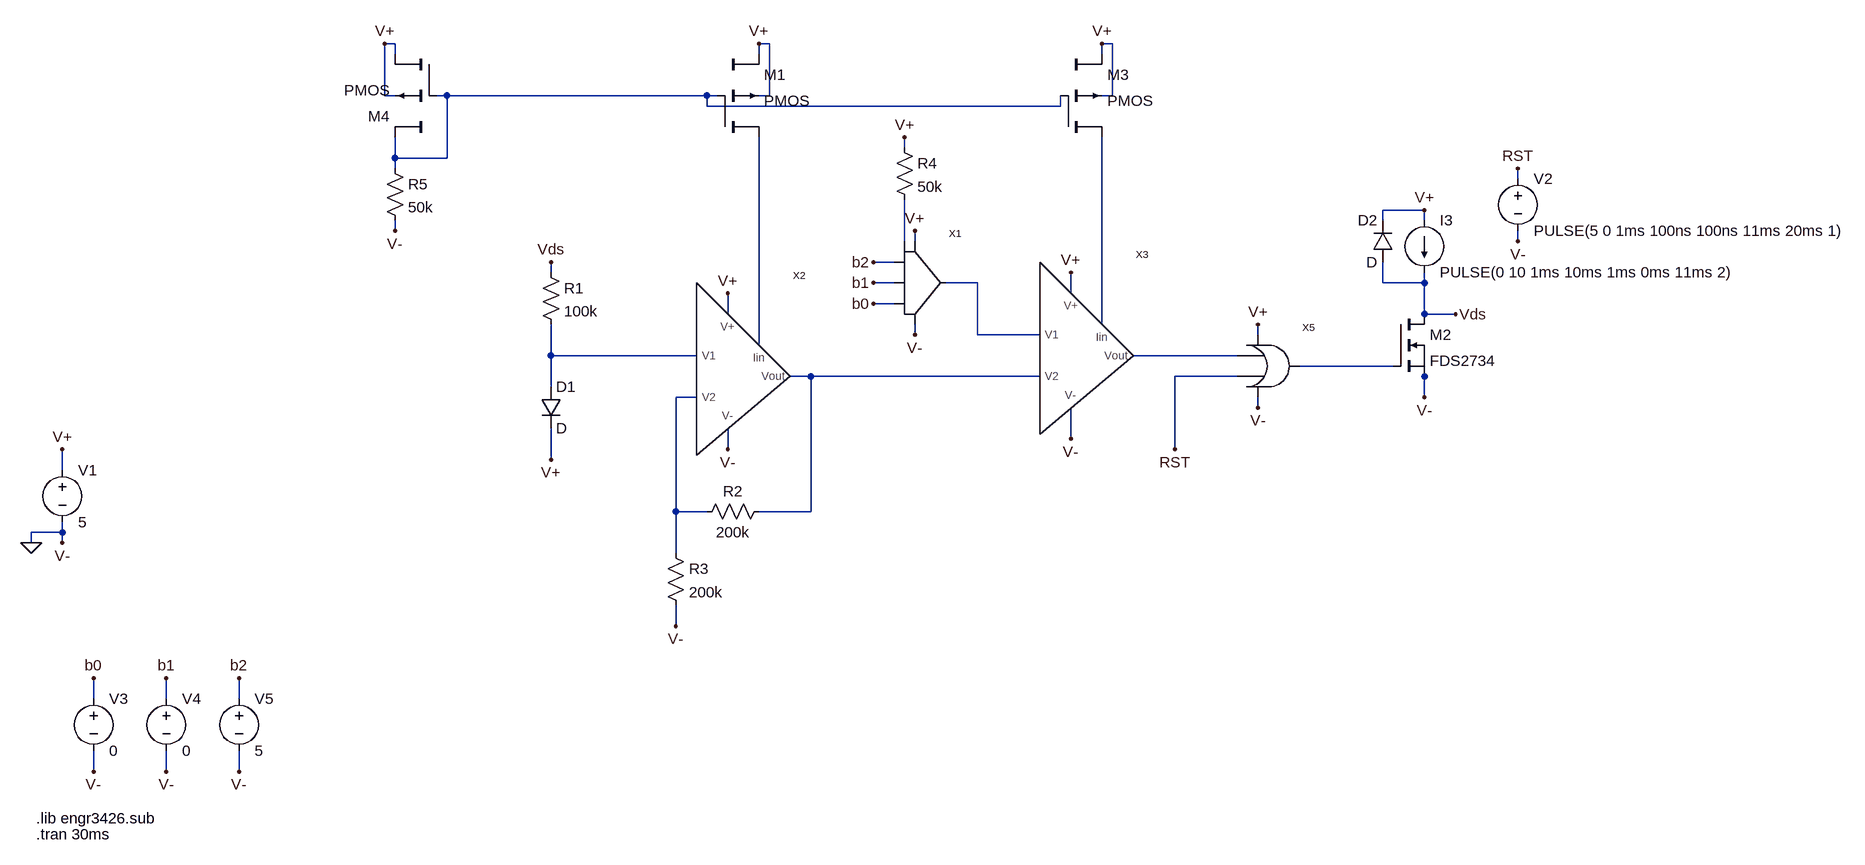
[diagram p0: schematic System.asc]
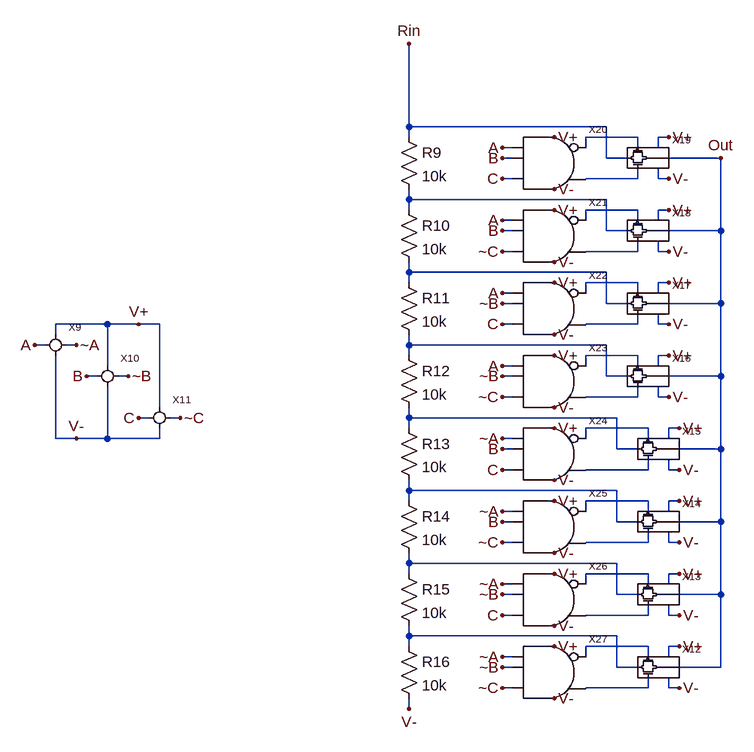
[diagram p1: sub-circuit dac.asc]
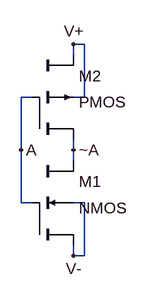
[diagram p2: sub-circuit inverter.asc]
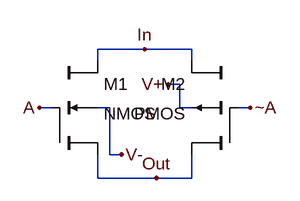
[diagram p3: sub-circuit passgate.asc]
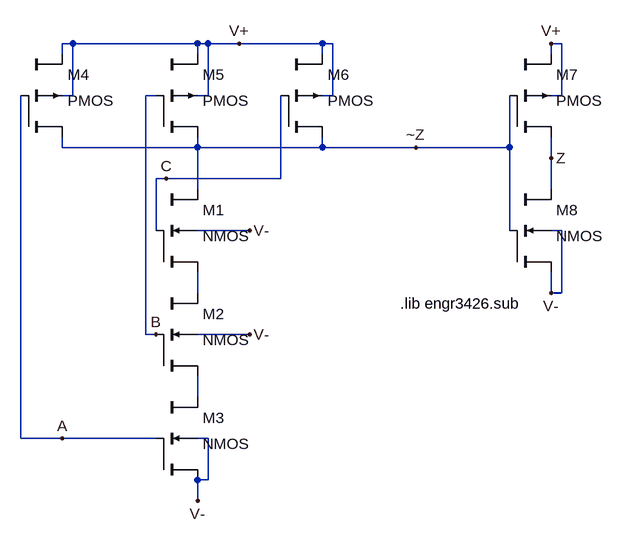
[diagram p4: sub-circuit 3-n-and.asc]
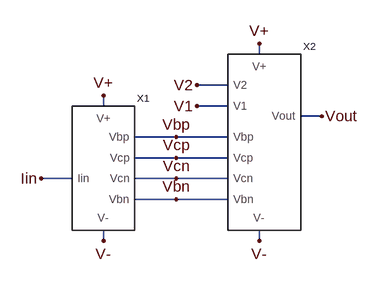
[diagram p5: sub-circuit opamp.asc]
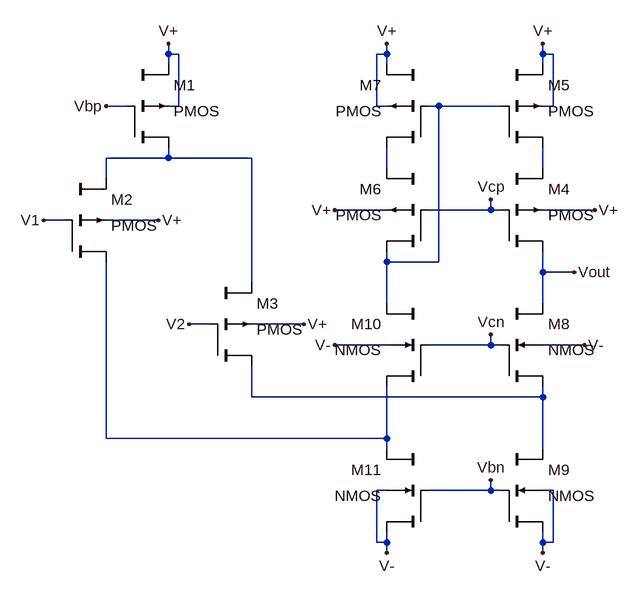
[diagram p6: sub-circuit fcdamp.asc]
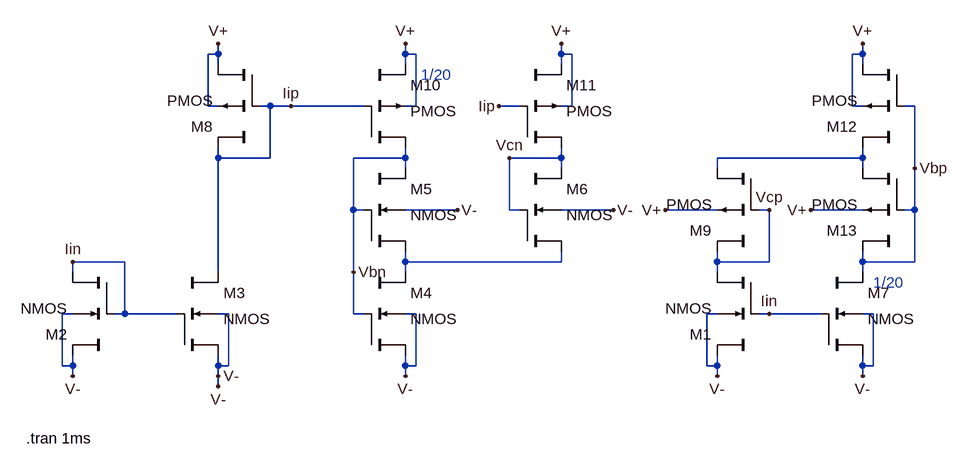
[diagram p7: sub-circuit bias.asc]
System.asc, the LTspice schematic file:
Version 4
SHEET 1 2444 848
WIRE -64 -384 -80 -384
WIRE 512 -384 496 -384
WIRE 1040 -384 1024 -384
WIRE -64 -368 -64 -384
WIRE 496 -368 496 -384
WIRE 1024 -368 1024 -384
WIRE -80 -304 -80 -384
WIRE -64 -304 -80 -304
WIRE 16 -304 0 -304
WIRE 416 -304 16 -304
WIRE 432 -304 416 -304
WIRE 512 -304 512 -384
WIRE 512 -304 496 -304
WIRE 1040 -304 1040 -384
WIRE 1040 -304 1024 -304
WIRE 416 -288 416 -304
WIRE 960 -288 960 -304
WIRE 960 -288 416 -288
WIRE 720 -224 720 -240
WIRE -64 -208 -64 -240
WIRE 16 -208 16 -304
WIRE 16 -208 -64 -208
WIRE -64 -192 -64 -208
WIRE 1664 -176 1664 -192
WIRE 1520 -128 1456 -128
WIRE 1456 -112 1456 -128
WIRE 1520 -112 1520 -128
WIRE -64 -96 -64 -112
WIRE 720 -80 720 -144
WIRE 736 -80 736 -96
WIRE 1664 -80 1664 -96
WIRE 704 -48 672 -48
WIRE 176 -32 176 -48
WIRE 704 -16 672 -16
WIRE 832 -16 784 -16
WIRE 1456 -16 1456 -48
WIRE 1520 -16 1520 -32
WIRE 1520 -16 1456 -16
WIRE 976 0 976 -32
WIRE 704 16 672 16
WIRE 448 32 448 0
WIRE 1520 32 1520 -16
WIRE 1568 32 1520 32
WIRE 1024 48 1024 -240
WIRE 736 64 736 48
WIRE 832 64 832 -16
WIRE 928 64 832 64
WIRE 1264 64 1264 48
WIRE 496 80 496 -240
WIRE 176 96 176 48
WIRE 400 96 176 96
WIRE 1232 96 1072 96
WIRE 1472 112 1328 112
WIRE 576 128 544 128
WIRE 928 128 576 128
WIRE 1232 128 1136 128
WIRE 1520 128 1520 112
WIRE 176 144 176 96
WIRE 400 160 368 160
WIRE 1520 160 1520 128
WIRE 1264 176 1264 160
WIRE 976 224 976 176
WIRE 448 240 448 208
WIRE 1136 240 1136 128
WIRE 176 256 176 208
WIRE -576 272 -576 240
WIRE 368 336 368 160
WIRE 416 336 368 336
WIRE 576 336 576 128
WIRE 576 336 496 336
WIRE -576 368 -576 352
WIRE -576 368 -624 368
WIRE -624 384 -624 368
WIRE -576 384 -576 368
WIRE 368 400 368 336
WIRE 368 512 368 480
WIRE -528 624 -528 592
WIRE -416 624 -416 592
WIRE -304 624 -304 592
WIRE -528 736 -528 704
WIRE -416 736 -416 704
WIRE -304 736 -304 704
FLAG 672 16 b0
FLAG 672 -16 b1
FLAG 672 -48 b2
FLAG 176 256 V+
FLAG 448 0 V+
FLAG 976 -32 V+
FLAG 448 240 V-
FLAG 976 224 V-
FLAG 176 -48 Vds
FLAG 368 512 V-
FLAG -576 384 V-
FLAG -528 736 V-
FLAG -416 736 V-
FLAG -304 736 V-
FLAG -576 240 V+
FLAG -528 592 b0
FLAG -416 592 b1
FLAG -304 592 b2
FLAG -624 384 0
FLAG 736 -96 V+
FLAG 736 64 V-
FLAG 720 -240 V+
FLAG 1520 -128 V+
FLAG 1520 160 V-
FLAG 1568 32 Vds
FLAG 1136 240 RST
FLAG 1264 48 V+
FLAG 1264 176 V-
FLAG 1664 -192 RST
FLAG 1664 -80 V-
FLAG -64 -96 V-
FLAG -80 -384 V+
FLAG 496 -384 V+
FLAG 1024 -384 V+
SYMBOL DAC 720 -16 R0
SYMATTR InstName X1
SYMBOL res 160 -48 R0
SYMATTR InstName R1
SYMATTR Value 100k
SYMBOL diode 160 144 R0
SYMATTR InstName D1
SYMBOL res 512 320 R90
WINDOW 0 0 56 VBottom 2
WINDOW 3 32 56 VTop 2
SYMATTR InstName R2
SYMATTR Value 200k
SYMBOL Opamp 368 128 R0
SYMATTR InstName X2
SYMBOL Opamp 896 96 R0
SYMATTR InstName X3
SYMBOL res 352 384 R0
SYMATTR InstName R3
SYMATTR Value 200k
SYMBOL voltage -576 256 R0
WINDOW 123 0 0 Left 2
WINDOW 39 0 0 Left 2
SYMATTR InstName V1
SYMATTR Value 5
SYMBOL voltage -528 608 R0
WINDOW 123 0 0 Left 2
WINDOW 39 0 0 Left 2
SYMATTR InstName V3
SYMATTR Value 0
SYMBOL voltage -416 608 R0
WINDOW 123 0 0 Left 2
WINDOW 39 0 0 Left 2
SYMATTR InstName V4
SYMATTR Value 0
SYMBOL voltage -304 608 R0
WINDOW 123 0 0 Left 2
WINDOW 39 0 0 Left 2
SYMATTR InstName V5
SYMATTR Value 5
SYMBOL res 704 -240 R0
SYMATTR InstName R4
SYMATTR Value 50k
SYMBOL current 1520 -112 R0
WINDOW 123 0 0 Left 2
WINDOW 39 0 0 Left 2
SYMATTR InstName I3
SYMATTR Value PULSE(0 10 1ms 10ms 1ms 0ms 11ms 2)
SYMBOL diode 1472 -48 R180
WINDOW 0 24 64 Left 2
WINDOW 3 24 0 Left 2
SYMATTR InstName D2
SYMBOL nmos 1472 32 R0
SYMATTR InstName M2
SYMATTR Value FDS2734
SYMBOL 2-OR 1248 144 R0
SYMATTR InstName X5
SYMBOL voltage 1664 -192 R0
WINDOW 123 0 0 Left 2
WINDOW 39 0 0 Left 2
SYMATTR InstName V2
SYMATTR Value PULSE(5 0 1ms 100ns 100ns 11ms 20ms 1)
SYMBOL cktsym\\pmos4 496 -304 R0
SYMATTR InstName M1
SYMATTR Value2 l=1.8um w=36um
SYMBOL cktsym\\pmos4 1024 -304 R0
SYMATTR InstName M3
SYMATTR Value2 l=1.8um w=36um
SYMBOL res -80 -208 R0
SYMATTR InstName R5
SYMATTR Value 50k
SYMBOL cktsym\\pmos4 -64 -304 R180
SYMATTR InstName M4
SYMATTR Value2 l=1.8um w=36um
TEXT -616 808 Left 2 !.lib engr3426.sub
TEXT -616 832 Left 2 !.tran 30ms

dac.asc, the sub-circuit schematic file:
Version 4
SHEET 1 1852 808
WIRE 80 -832 80 -960
WIRE 384 -832 80 -832
WIRE 80 -816 80 -832
WIRE 304 -816 288 -816
WIRE 432 -816 352 -816
WIRE 480 -816 464 -816
WIRE 240 -800 224 -800
WIRE 352 -800 352 -816
WIRE 432 -800 432 -816
WIRE 464 -800 464 -816
WIRE 240 -784 224 -784
WIRE 384 -784 384 -832
WIRE 416 -784 384 -784
WIRE 560 -784 480 -784
WIRE 240 -752 224 -752
WIRE 432 -752 432 -768
WIRE 432 -752 352 -752
WIRE 464 -752 464 -768
WIRE 480 -752 464 -752
WIRE 304 -736 288 -736
WIRE 80 -720 80 -736
WIRE 384 -720 80 -720
WIRE 80 -704 80 -720
WIRE 304 -704 288 -704
WIRE 432 -704 352 -704
WIRE 480 -704 464 -704
WIRE 240 -688 224 -688
WIRE 352 -688 352 -704
WIRE 432 -688 432 -704
WIRE 464 -688 464 -704
WIRE 240 -672 224 -672
WIRE 384 -672 384 -720
WIRE 416 -672 384 -672
WIRE 560 -672 560 -784
WIRE 560 -672 480 -672
WIRE 240 -640 224 -640
WIRE 432 -640 432 -656
WIRE 432 -640 352 -640
WIRE 464 -640 464 -656
WIRE 480 -640 464 -640
WIRE 304 -624 288 -624
WIRE 80 -608 80 -624
WIRE 384 -608 80 -608
WIRE 80 -592 80 -608
WIRE 304 -592 288 -592
WIRE 432 -592 352 -592
WIRE 480 -592 464 -592
WIRE 240 -576 224 -576
WIRE 352 -576 352 -592
WIRE 432 -576 432 -592
WIRE 464 -576 464 -592
WIRE 240 -560 224 -560
WIRE 384 -560 384 -608
WIRE 416 -560 384 -560
WIRE 560 -560 560 -672
WIRE 560 -560 480 -560
WIRE -384 -528 -464 -528
WIRE -336 -528 -384 -528
WIRE -304 -528 -336 -528
WIRE 240 -528 224 -528
WIRE 432 -528 432 -544
WIRE 432 -528 352 -528
WIRE 464 -528 464 -544
WIRE 480 -528 464 -528
WIRE -464 -512 -464 -528
WIRE 304 -512 288 -512
WIRE -480 -496 -496 -496
WIRE -432 -496 -448 -496
WIRE 80 -496 80 -512
WIRE 384 -496 80 -496
WIRE 80 -480 80 -496
WIRE 304 -480 288 -480
WIRE 432 -480 352 -480
WIRE 480 -480 464 -480
WIRE -384 -464 -384 -528
WIRE 240 -464 224 -464
WIRE 352 -464 352 -480
WIRE 432 -464 432 -480
WIRE 464 -464 464 -480
WIRE -400 -448 -416 -448
WIRE -352 -448 -368 -448
WIRE 240 -448 224 -448
WIRE 384 -448 384 -496
WIRE 416 -448 384 -448
WIRE 560 -448 560 -560
WIRE 560 -448 480 -448
WIRE 240 -416 224 -416
WIRE 432 -416 432 -432
WIRE 432 -416 352 -416
WIRE 464 -416 464 -432
WIRE 480 -416 464 -416
WIRE -304 -400 -304 -528
WIRE 304 -400 288 -400
WIRE -320 -384 -336 -384
WIRE -272 -384 -288 -384
WIRE 80 -384 80 -400
WIRE 400 -384 80 -384
WIRE 80 -368 80 -384
WIRE 304 -368 288 -368
WIRE 448 -368 352 -368
WIRE 496 -368 480 -368
WIRE -464 -352 -464 -480
WIRE -432 -352 -464 -352
WIRE -384 -352 -384 -432
WIRE -384 -352 -432 -352
WIRE -304 -352 -304 -368
WIRE -304 -352 -384 -352
WIRE 240 -352 224 -352
WIRE 352 -352 352 -368
WIRE 448 -352 448 -368
WIRE 480 -352 480 -368
WIRE 240 -336 224 -336
WIRE 400 -336 400 -384
WIRE 432 -336 400 -336
WIRE 560 -336 560 -448
WIRE 560 -336 496 -336
WIRE 240 -304 224 -304
WIRE 448 -304 448 -320
WIRE 448 -304 352 -304
WIRE 480 -304 480 -320
WIRE 496 -304 480 -304
WIRE 304 -288 288 -288
WIRE 80 -272 80 -288
WIRE 400 -272 80 -272
WIRE 80 -256 80 -272
WIRE 304 -256 288 -256
WIRE 448 -256 352 -256
WIRE 496 -256 480 -256
WIRE 240 -240 224 -240
WIRE 352 -240 352 -256
WIRE 448 -240 448 -256
WIRE 480 -240 480 -256
WIRE 240 -224 224 -224
WIRE 400 -224 400 -272
WIRE 432 -224 400 -224
WIRE 560 -224 560 -336
WIRE 560 -224 496 -224
WIRE 240 -192 224 -192
WIRE 448 -192 448 -208
WIRE 448 -192 352 -192
WIRE 480 -192 480 -208
WIRE 496 -192 480 -192
WIRE 304 -176 288 -176
WIRE 80 -160 80 -176
WIRE 400 -160 80 -160
WIRE 80 -144 80 -160
WIRE 304 -144 288 -144
WIRE 448 -144 352 -144
WIRE 496 -144 480 -144
WIRE 240 -128 224 -128
WIRE 352 -128 352 -144
WIRE 448 -128 448 -144
WIRE 480 -128 480 -144
WIRE 240 -112 224 -112
WIRE 400 -112 400 -160
WIRE 432 -112 400 -112
WIRE 560 -112 560 -224
WIRE 560 -112 496 -112
WIRE 240 -80 224 -80
WIRE 448 -80 448 -96
WIRE 448 -80 352 -80
WIRE 480 -80 480 -96
WIRE 496 -80 480 -80
WIRE 304 -64 288 -64
WIRE 80 -48 80 -64
WIRE 400 -48 80 -48
WIRE 80 -32 80 -48
WIRE 304 -32 288 -32
WIRE 448 -32 352 -32
WIRE 496 -32 480 -32
WIRE 240 -16 224 -16
WIRE 352 -16 352 -32
WIRE 448 -16 448 -32
WIRE 480 -16 480 -32
WIRE 240 0 224 0
WIRE 400 0 400 -48
WIRE 432 0 400 0
WIRE 560 0 560 -112
WIRE 560 0 496 0
WIRE 240 32 224 32
WIRE 448 32 448 16
WIRE 448 32 352 32
WIRE 480 32 480 16
WIRE 496 32 480 32
WIRE 304 48 288 48
WIRE 80 64 80 48
FLAG 80 64 V-
FLAG 80 -960 Rin
FLAG 224 -800 A
FLAG 224 -688 A
FLAG 224 -576 A
FLAG 224 -464 A
FLAG 224 -352 ~A
FLAG 224 -240 ~A
FLAG 224 -128 ~A
FLAG 224 -16 ~A
FLAG 224 -784 B
FLAG 224 -672 B
FLAG 224 -336 B
FLAG 224 -224 B
FLAG 224 -560 ~B
FLAG 224 -448 ~B
FLAG 224 -112 ~B
FLAG 224 0 ~B
FLAG 224 -752 C
FLAG 224 -528 C
FLAG 224 -304 C
FLAG 224 -80 C
FLAG 224 -640 ~C
FLAG 224 -416 ~C
FLAG 224 -192 ~C
FLAG 224 32 ~C
FLAG -496 -496 A
FLAG -432 -496 ~A
FLAG -416 -448 B
FLAG -352 -448 ~B
FLAG -336 -384 C
FLAG -272 -384 ~C
FLAG -336 -528 V+
FLAG -432 -352 V-
FLAG 496 -32 V+
FLAG 496 32 V-
FLAG 496 -144 V+
FLAG 496 -80 V-
FLAG 496 -256 V+
FLAG 496 -192 V-
FLAG 496 -368 V+
FLAG 496 -304 V-
FLAG 480 -480 V+
FLAG 480 -416 V-
FLAG 480 -592 V+
FLAG 480 -528 V-
FLAG 480 -704 V+
FLAG 480 -640 V-
FLAG 480 -816 V+
FLAG 480 -752 V-
FLAG 304 -816 V+
FLAG 304 -704 V+
FLAG 304 -592 V+
FLAG 304 -480 V+
FLAG 304 -368 V+
FLAG 304 -256 V+
FLAG 304 -144 V+
FLAG 304 -32 V+
FLAG 304 48 V-
FLAG 304 -64 V-
FLAG 304 -176 V-
FLAG 304 -288 V-
FLAG 304 -400 V-
FLAG 304 -512 V-
FLAG 304 -624 V-
FLAG 304 -736 V-
FLAG 560 -784 Out
SYMBOL res 64 -832 R0
SYMATTR InstName R9
SYMATTR Value 10k
SYMBOL res 64 -720 R0
SYMATTR InstName R10
SYMATTR Value 10k
SYMBOL res 64 -608 R0
SYMATTR InstName R11
SYMATTR Value 10k
SYMBOL res 64 -496 R0
SYMATTR InstName R12
SYMATTR Value 10k
SYMBOL res 64 -384 R0
SYMATTR InstName R13
SYMATTR Value 10k
SYMBOL res 64 -272 R0
SYMATTR InstName R14
SYMATTR Value 10k
SYMBOL res 64 -160 R0
SYMATTR InstName R15
SYMATTR Value 10k
SYMBOL res 64 -48 R0
SYMATTR InstName R16
SYMATTR Value 10k
SYMBOL Inverter -464 -496 R0
SYMATTR InstName X9
SYMBOL Inverter -384 -448 R0
SYMATTR InstName X10
SYMBOL Inverter -304 -384 R0
SYMATTR InstName X11
SYMBOL PassGate 464 0 R0
SYMATTR InstName X12
SYMBOL PassGate 464 -112 R0
SYMATTR InstName X13
SYMBOL PassGate 464 -224 R0
SYMATTR InstName X14
SYMBOL PassGate 464 -336 R0
SYMATTR InstName X15
SYMBOL PassGate 448 -448 R0
SYMATTR InstName X16
SYMBOL PassGate 448 -560 R0
SYMATTR InstName X17
SYMBOL PassGate 448 -672 R0
SYMATTR InstName X18
SYMBOL PassGate 448 -784 R0
SYMATTR InstName X19
SYMBOL 3-N-AND 256 -736 R0
SYMATTR InstName X20
SYMBOL 3-N-AND 256 -624 R0
SYMATTR InstName X21
SYMBOL 3-N-AND 256 -512 R0
SYMATTR InstName X22
SYMBOL 3-N-AND 256 -400 R0
SYMATTR InstName X23
SYMBOL 3-N-AND 256 -288 R0
SYMATTR InstName X24
SYMBOL 3-N-AND 256 -176 R0
SYMATTR InstName X25
SYMBOL 3-N-AND 256 -64 R0
SYMATTR InstName X26
SYMBOL 3-N-AND 256 48 R0
SYMATTR InstName X27

inverter.asc, the sub-circuit schematic file:
Version 4
SHEET 1 880 680
WIRE 288 32 272 32
WIRE 272 48 272 32
WIRE 208 112 192 112
WIRE 288 112 288 32
WIRE 288 112 272 112
WIRE 192 192 192 112
WIRE 272 192 272 176
WIRE 272 208 272 192
WIRE 192 272 192 192
WIRE 208 272 192 272
WIRE 288 272 272 272
WIRE 272 352 272 336
WIRE 288 352 288 272
WIRE 288 352 272 352
FLAG 192 192 A
FLAG 272 192 ~A
FLAG 272 32 V+
FLAG 272 352 V-
SYMBOL cktsym\\nmos4 272 272 R0
SYMATTR InstName M1
SYMATTR Value2 l=0.6um w=1.8um
SYMBOL cktsym\\pmos4 272 112 R0
SYMATTR InstName M2
SYMATTR Value2 l=0.6um w=1.8um

passgate.asc, the sub-circuit schematic file:
Version 4
SHEET 1 880 680
WIRE 256 128 192 128
WIRE 320 128 256 128
WIRE 192 144 192 128
WIRE 320 144 320 128
WIRE 304 176 288 176
WIRE 128 208 112 208
WIRE 208 208 192 208
WIRE 304 208 304 176
WIRE 320 208 304 208
WIRE 400 208 384 208
WIRE 208 272 208 208
WIRE 224 272 208 272
WIRE 192 304 192 272
WIRE 272 304 192 304
WIRE 320 304 320 272
WIRE 320 304 272 304
FLAG 224 272 V-
FLAG 288 176 V+
FLAG 256 128 In
FLAG 272 304 Out
FLAG 112 208 A
FLAG 400 208 ~A
SYMBOL cktsym\\nmos4 192 208 R0
SYMATTR InstName M1
SYMATTR Value2 l=0.6um w=1.8um
SYMBOL cktsym\\pmos4 320 208 M0
SYMATTR InstName M2
SYMATTR Value2 l=0.6um w=1.8um

3-n-and.asc, the sub-circuit schematic file:
Version 4
SHEET 1 880 680
WIRE -128 -96 -144 -96
WIRE 64 -96 -128 -96
WIRE 80 -96 64 -96
WIRE 128 -96 80 -96
WIRE 256 -96 128 -96
WIRE 272 -96 256 -96
WIRE 624 -96 608 -96
WIRE -144 -80 -144 -96
WIRE 64 -80 64 -96
WIRE 256 -80 256 -96
WIRE 608 -80 608 -96
WIRE -128 -16 -128 -96
WIRE -128 -16 -144 -16
WIRE 0 -16 -16 -16
WIRE 80 -16 80 -96
WIRE 80 -16 64 -16
WIRE 272 -16 272 -96
WIRE 272 -16 256 -16
WIRE 624 -16 624 -96
WIRE 624 -16 608 -16
WIRE -144 64 -144 48
WIRE 64 64 64 48
WIRE 64 64 -144 64
WIRE 256 64 256 48
WIRE 256 64 64 64
WIRE 400 64 256 64
WIRE 544 64 544 -16
WIRE 544 64 400 64
WIRE 608 80 608 48
WIRE 16 112 0 112
WIRE 192 112 192 -16
WIRE 192 112 16 112
WIRE 64 128 64 64
WIRE 608 128 608 80
WIRE 0 192 0 112
WIRE 144 192 64 192
WIRE 544 192 544 64
WIRE 624 192 608 192
WIRE 64 288 64 256
WIRE 608 288 608 256
WIRE 624 288 624 192
WIRE 624 288 608 288
WIRE -16 352 -16 -16
WIRE 0 352 -16 352
WIRE 144 352 64 352
WIRE 64 448 64 416
WIRE -208 512 -208 -16
WIRE -144 512 -208 512
WIRE 0 512 -144 512
WIRE 80 512 64 512
WIRE 80 576 80 512
WIRE 80 576 64 576
WIRE 64 608 64 576
FLAG -144 512 A
FLAG 0 352 B
FLAG 16 112 C
FLAG 128 -96 V+
FLAG 144 192 V-
FLAG 144 352 V-
FLAG 64 608 V-
FLAG 608 288 V-
FLAG 608 -96 V+
FLAG 400 64 ~Z
FLAG 608 80 Z
SYMBOL cktsym\\nmos4 64 192 R0
SYMATTR InstName M1
SYMATTR Value2 l=0.6um w=1.8um
SYMBOL cktsym\\nmos4 64 352 R0
SYMATTR InstName M2
SYMATTR Value2 l=0.6um w=1.8um
SYMBOL cktsym\\nmos4 64 512 R0
SYMATTR InstName M3
SYMATTR Value2 l=0.6um w=1.8um
SYMBOL cktsym\\pmos4 -144 -16 R0
SYMATTR InstName M4
SYMATTR Value2 l=0.6um w=1.8um
SYMBOL cktsym\\pmos4 64 -16 R0
SYMATTR InstName M5
SYMATTR Value2 l=0.6um w=1.8um
SYMBOL cktsym\\pmos4 256 -16 R0
SYMATTR InstName M6
SYMATTR Value2 l=0.6um w=1.8um
SYMBOL cktsym\\pmos4 608 -16 R0
SYMATTR InstName M7
SYMATTR Value2 l=0.6um w=1.8um
SYMBOL cktsym\\nmos4 608 192 R0
SYMATTR InstName M8
SYMATTR Value2 l=0.6um w=1.8um
TEXT 376 304 Left 2 !.lib engr3426.sub

opamp.asc, the sub-circuit schematic file:
Version 4
SHEET 1 880 680
WIRE 352 0 352 -16
WIRE 304 48 256 48
WIRE 112 80 112 64
WIRE 304 80 256 80
WIRE 448 96 416 96
WIRE 224 128 160 128
WIRE 304 128 224 128
WIRE 224 160 160 160
WIRE 304 160 224 160
WIRE 64 192 16 192
WIRE 224 192 160 192
WIRE 304 192 224 192
WIRE 224 224 160 224
WIRE 304 224 224 224
WIRE 112 288 112 272
WIRE 352 288 352 272
FLAG 352 -16 V+
FLAG 112 64 V+
FLAG 256 80 V1
FLAG 256 48 V2
FLAG 16 192 Iin
FLAG 224 224 Vbn
FLAG 224 192 Vcn
FLAG 224 160 Vcp
FLAG 224 128 Vbp
FLAG 448 96 Vout
FLAG 112 288 V-
FLAG 352 288 V-
SYMBOL FCDAmp 336 160 R0
SYMATTR InstName X2
SYMBOL Bias 96 160 R0
SYMATTR InstName X1

fcdamp.asc, the sub-circuit schematic file:
Version 4
SHEET 1 880 808
WIRE 144 -32 144 -48
WIRE 160 -32 144 -32
WIRE 480 -32 480 -48
WIRE 480 -32 464 -32
WIRE 720 -32 720 -48
WIRE 736 -32 720 -32
WIRE 144 -16 144 -32
WIRE 480 -16 480 -32
WIRE 720 -16 720 -32
WIRE 80 48 48 48
WIRE 160 48 160 -32
WIRE 160 48 144 48
WIRE 464 48 464 -32
WIRE 480 48 464 48
WIRE 560 48 544 48
WIRE 656 48 560 48
WIRE 736 48 736 -32
WIRE 736 48 720 48
WIRE 144 128 144 112
WIRE 144 128 48 128
WIRE 272 128 144 128
WIRE 480 144 480 112
WIRE 720 144 720 112
WIRE 48 160 48 128
WIRE 480 208 400 208
WIRE 640 208 640 192
WIRE 640 208 544 208
WIRE 656 208 640 208
WIRE 800 208 720 208
WIRE -16 224 -48 224
WIRE 128 224 48 224
WIRE 480 288 480 272
WIRE 560 288 560 48
WIRE 560 288 480 288
WIRE 720 304 720 272
WIRE 768 304 720 304
WIRE 272 320 272 128
WIRE 480 352 480 288
WIRE 720 352 720 304
WIRE 208 384 176 384
WIRE 352 384 272 384
WIRE 480 416 400 416
WIRE 640 416 640 400
WIRE 640 416 544 416
WIRE 656 416 640 416
WIRE 784 416 720 416
WIRE 272 496 272 448
WIRE 720 496 720 480
WIRE 720 496 272 496
WIRE 48 560 48 288
WIRE 480 560 480 480
WIRE 480 560 48 560
WIRE 480 576 480 560
WIRE 720 576 720 496
WIRE 480 640 464 640
WIRE 640 640 640 624
WIRE 640 640 544 640
WIRE 656 640 640 640
WIRE 736 640 720 640
WIRE 464 720 464 640
WIRE 480 720 480 704
WIRE 480 720 464 720
WIRE 720 720 720 704
WIRE 736 720 736 640
WIRE 736 720 720 720
WIRE 480 736 480 720
WIRE 720 736 720 720
FLAG 128 224 V+
FLAG 352 384 V+
FLAG 400 208 V+
FLAG 480 -48 V+
FLAG 720 -48 V+
FLAG 144 -48 V+
FLAG 400 416 V-
FLAG 784 416 V-
FLAG 720 736 V-
FLAG 480 736 V-
FLAG 800 208 V+
FLAG 768 304 Vout
FLAG -48 224 V1
FLAG 176 384 V2
FLAG 48 48 Vbp
FLAG 640 192 Vcp
FLAG 640 400 Vcn
FLAG 640 624 Vbn
SYMBOL cktsym\\pmos4 144 48 R0
SYMATTR InstName M1
SYMATTR Value2 l=1.8um w=36um
SYMBOL cktsym\\pmos4 48 224 R0
SYMATTR InstName M2
SYMATTR Value2 l=1.8um w=36um
SYMBOL cktsym\\pmos4 272 384 R0
SYMATTR InstName M3
SYMATTR Value2 l=1.8um w=36um
SYMBOL cktsym\\pmos4 720 208 R0
SYMATTR InstName M4
SYMATTR Value2 l=1.8um w=36um
SYMBOL cktsym\\pmos4 720 48 R0
SYMATTR InstName M5
SYMATTR Value2 l=1.8um w=36um
SYMBOL cktsym\\pmos4 480 208 M0
SYMATTR InstName M6
SYMATTR Value2 l=1.8um w=36um
SYMBOL cktsym\\pmos4 480 48 M0
SYMATTR InstName M7
SYMATTR Value2 l=1.8um w=36um
SYMBOL cktsym\\nmos4 720 416 R0
SYMATTR InstName M8
SYMATTR Value2 l=1.8um w=36um
SYMBOL cktsym\\nmos4 720 640 R0
SYMATTR InstName M9
SYMATTR Value2 l=1.8um w=36um
SYMBOL cktsym\\nmos4 480 416 M0
SYMATTR InstName M10
SYMATTR Value2 l=1.8um w=36um
SYMBOL cktsym\\nmos4 480 640 M0
SYMATTR InstName M11
SYMATTR Value2 l=1.8um w=36um

bias.asc, the sub-circuit schematic file:
Version 4
SHEET 1 880 680
WIRE -752 -240 -752 -256
WIRE -752 -240 -768 -240
WIRE -464 -240 -464 -256
WIRE -448 -240 -464 -240
WIRE -224 -240 -224 -256
WIRE -208 -240 -224 -240
WIRE 240 -240 240 -256
WIRE 240 -240 224 -240
WIRE -752 -224 -752 -240
WIRE -464 -224 -464 -240
WIRE -224 -224 -224 -240
WIRE 240 -224 240 -240
WIRE -768 -160 -768 -240
WIRE -752 -160 -768 -160
WIRE -672 -160 -688 -160
WIRE -640 -160 -672 -160
WIRE -528 -160 -640 -160
WIRE -448 -160 -448 -240
WIRE -448 -160 -464 -160
WIRE -288 -160 -320 -160
WIRE -208 -160 -208 -240
WIRE -208 -160 -224 -160
WIRE 224 -160 224 -240
WIRE 240 -160 224 -160
WIRE 320 -160 304 -160
WIRE -752 -80 -752 -96
WIRE -672 -80 -672 -160
WIRE -672 -80 -752 -80
WIRE -464 -80 -464 -96
WIRE -464 -80 -544 -80
WIRE -224 -80 -224 -96
WIRE -224 -80 -304 -80
WIRE 240 -80 240 -96
WIRE 240 -80 16 -80
WIRE -464 -64 -464 -80
WIRE -224 -64 -224 -80
WIRE 16 -64 16 -80
WIRE 240 -64 240 -80
WIRE 320 -64 320 -160
WIRE -544 0 -544 -80
WIRE -528 0 -544 0
WIRE -384 0 -464 0
WIRE -304 0 -304 -80
WIRE -288 0 -304 0
WIRE -144 0 -224 0
WIRE 16 0 -64 0
WIRE 96 0 80 0
WIRE 240 0 160 0
WIRE 320 0 320 -64
WIRE 320 0 304 0
WIRE -896 80 -976 80
WIRE -464 80 -464 64
WIRE -224 80 -224 64
WIRE -224 80 -464 80
WIRE 16 80 16 64
WIRE 96 80 96 0
WIRE 96 80 16 80
WIRE 240 80 240 64
WIRE 320 80 320 0
WIRE 320 80 240 80
WIRE -976 96 -976 80
WIRE -752 96 -752 -80
WIRE -544 96 -544 0
WIRE -464 96 -464 80
WIRE 16 96 16 80
WIRE 240 96 240 80
WIRE -976 160 -992 160
WIRE -896 160 -896 80
WIRE -896 160 -912 160
WIRE -816 160 -896 160
WIRE -736 160 -752 160
WIRE -544 160 -544 96
WIRE -528 160 -544 160
WIRE -448 160 -464 160
WIRE 16 160 0 160
WIRE 96 160 80 160
WIRE 176 160 96 160
WIRE 256 160 240 160
WIRE -992 240 -992 160
WIRE -976 240 -976 224
WIRE -976 240 -992 240
WIRE -752 240 -752 224
WIRE -736 240 -736 160
WIRE -736 240 -752 240
WIRE -464 240 -464 224
WIRE -448 240 -448 160
WIRE -448 240 -464 240
WIRE 0 240 0 160
WIRE 16 240 16 224
WIRE 16 240 0 240
WIRE 240 240 240 224
WIRE 256 240 256 160
WIRE 256 240 240 240
WIRE -976 256 -976 240
WIRE -752 256 -752 240
WIRE -464 256 -464 240
WIRE 16 256 16 240
WIRE 240 256 240 240
WIRE -752 272 -752 256
FLAG -752 -256 V+
FLAG -464 -256 V+
FLAG -224 -256 V+
FLAG -752 272 V-
FLAG -976 256 V-
FLAG -752 256 V-
FLAG -464 256 V-
FLAG 16 256 V-
FLAG 240 256 V-
FLAG -144 0 V-
FLAG -384 0 V-
FLAG -64 0 V+
FLAG 240 -256 V+
FLAG 160 0 V+
FLAG -304 -80 Vcn
FLAG 96 0 Vcp
FLAG -544 96 Vbn
FLAG 320 -64 Vbp
FLAG -976 80 Iin
FLAG 96 160 Iin
FLAG -640 -160 Iip
FLAG -320 -160 Iip
SYMBOL cktsym\\nmos4 16 160 R180
SYMATTR InstName M1
SYMATTR Value2 l=1.8um w=36um
SYMBOL cktsym\\nmos4 -976 160 R180
SYMATTR InstName M2
SYMATTR Value2 l=1.8um w=36um
SYMBOL cktsym\\nmos4 -752 160 R0
SYMATTR InstName M3
SYMATTR Value2 l=1.8um w=36um
SYMBOL cktsym\\nmos4 -464 160 R0
SYMATTR InstName M4
SYMATTR Value2 l=1.8um w=36um
SYMBOL cktsym\\nmos4 -464 0 R0
SYMATTR InstName M5
SYMATTR Value2 l=1.8um w=36um
SYMBOL cktsym\\nmos4 -224 0 R0
SYMATTR InstName M6
SYMATTR Value2 l=1.8um w=36um
SYMBOL cktsym\\nmos4 240 160 R0
SYMATTR InstName M7
SYMATTR Value2 l=1.8um w=1.8um
SYMBOL cktsym\\pmos4 -752 -160 R180
SYMATTR InstName M8
SYMATTR Value2 l=1.8um w=36um
SYMBOL cktsym\\pmos4 16 0 R180
SYMATTR InstName M9
SYMATTR Value2 l=1.8um w=36um
SYMBOL cktsym\\pmos4 -464 -160 R0
SYMATTR InstName M10
SYMATTR Value2 l=1.8um w=1.8um
SYMBOL cktsym\\pmos4 -224 -160 R0
SYMATTR InstName M11
SYMATTR Value2 l=1.8um w=36um
SYMBOL cktsym\\pmos4 240 -160 R180
SYMATTR InstName M12
SYMATTR Value2 l=1.8um w=36um
SYMBOL cktsym\\pmos4 240 0 R180
SYMATTR InstName M13
SYMATTR Value2 l=1.8um w=36um
TEXT -440 -208 Left 2 ;1/20
TEXT 256 112 Left 2 ;1/20
TEXT -1048 352 Left 2 !.tran 1ms

2-or.asc, the sub-circuit schematic file:
Version 4
SHEET 1 984 680
WIRE 272 -80 256 -80
WIRE 368 -80 272 -80
WIRE 560 -80 368 -80
WIRE 576 -80 560 -80
WIRE 752 -80 576 -80
WIRE 768 -80 752 -80
WIRE 912 -80 768 -80
WIRE 928 -80 912 -80
WIRE 272 -64 272 -80
WIRE 560 -64 560 -80
WIRE 752 -64 752 -80
WIRE 912 -64 912 -80
WIRE 256 0 256 -80
WIRE 272 0 256 0
WIRE 384 0 336 0
WIRE 416 0 384 0
WIRE 496 0 480 0
WIRE 576 0 576 -80
WIRE 576 0 560 0
WIRE 688 0 672 0
WIRE 768 0 768 -80
WIRE 768 0 752 0
WIRE 848 0 832 0
WIRE 928 0 928 -80
WIRE 928 0 912 0
WIRE 272 80 272 64
WIRE 560 80 560 64
WIRE 672 80 672 0
WIRE 672 80 560 80
WIRE 752 80 752 64
WIRE 832 80 832 0
WIRE 832 80 752 80
WIRE 912 80 912 64
WIRE 560 96 560 80
WIRE 752 96 752 80
WIRE 912 96 912 80
WIRE 208 144 64 144
WIRE 336 144 272 144
WIRE 480 160 480 0
WIRE 496 160 480 160
WIRE 576 160 560 160
WIRE 672 160 672 80
WIRE 688 160 672 160
WIRE 768 160 752 160
WIRE 832 160 832 80
WIRE 848 160 832 160
WIRE 928 160 912 160
WIRE 272 224 272 208
WIRE 272 224 208 224
WIRE 352 224 272 224
WIRE 480 224 480 160
WIRE 480 224 352 224
WIRE 208 240 208 224
WIRE 352 240 352 224
WIRE 560 240 560 224
WIRE 576 240 576 160
WIRE 576 240 560 240
WIRE 752 240 752 224
WIRE 752 240 576 240
WIRE 768 240 768 160
WIRE 768 240 752 240
WIRE 912 240 912 224
WIRE 912 240 768 240
WIRE 928 240 928 160
WIRE 928 240 912 240
WIRE 64 304 64 144
WIRE 144 304 64 304
WIRE 224 304 208 304
WIRE 352 304 336 304
WIRE 416 304 416 0
WIRE 208 384 208 368
WIRE 224 384 224 304
WIRE 224 384 208 384
WIRE 336 384 336 304
WIRE 336 384 224 384
WIRE 352 384 352 368
WIRE 352 384 336 384
WIRE 560 384 560 240
WIRE 560 384 352 384
FLAG 208 384 V-
FLAG 64 144 A
FLAG 336 144 V+
FLAG 368 -80 V+
FLAG 384 0 B
FLAG 912 80 Z
SYMBOL cktsym\\nmos4 208 304 R0
SYMATTR InstName M2
SYMATTR Value2 l=0.6um w=1.8um
SYMBOL cktsym\\pmos4 560 0 R0
SYMATTR InstName M5
SYMATTR Value2 l=0.6um w=3.6um
SYMBOL cktsym\\nmos4 560 160 R0
SYMATTR InstName M6
SYMATTR Value2 l=0.6um w=1.8um
SYMBOL cktsym\\nmos4 352 304 R180
SYMATTR InstName M1
SYMATTR Value2 l=0.6um w=1.8um
SYMBOL cktsym\\pmos4 272 144 R0
SYMATTR InstName M3
SYMATTR Value2 l=0.6um w=1.8um
SYMBOL cktsym\\pmos4 272 0 R180
SYMATTR InstName M4
SYMATTR Value2 l=0.6um w=1.8um
SYMBOL cktsym\\nmos4 752 160 R0
SYMATTR InstName M7
SYMATTR Value2 l=0.6um w=18um
SYMBOL cktsym\\nmos4 912 160 R0
SYMATTR InstName M8
SYMATTR Value2 l=0.6um w=180um
SYMBOL cktsym\\pmos4 752 0 R0
SYMATTR InstName M9
SYMATTR Value2 l=0.6um w=36um
SYMBOL cktsym\\pmos4 912 0 R0
SYMATTR InstName M10
SYMATTR Value2 l=0.6um w=360um

The netlist it stands for:
* System.asc
XX1 b0 b1 b2 N003 V+ 0 N002 dac
R1 Vds N006 100k
D1 N006 V+ D
R2 N009 N010 200k
XX2 N006 N010 V+ 0 N009 N005 opamp
XX3 N003 N009 V+ 0 N007 N004 opamp
R3 N010 0 200k
V1 V+ 0 5
V3 b0 0 0
V4 b1 0 0
V5 b2 0 5
R4 V+ N002 50k
I3 V+ Vds PULSE(0 10 1ms 10ms 1ms 0ms 11ms 2)
D2 Vds V+ D
M2 Vds N008 0 0 FDS2734
XX5 N007 RST 0 V+ N008 2-or
V2 RST 0 PULSE(5 0 1ms 100ns 100ns 11ms 20ms 1)
M1 N005 N001 V+ V+ PMOS l=1.8um w=36um
M3 N004 N001 V+ V+ PMOS l=1.8um w=36um
R5 N001 0 50k
M4 V+ N001 N001 V+ PMOS l=1.8um w=36um

* block symbol definitions
.subckt dac C B A Out V+ V- Rin
R9 Rin N003 10k
R10 N003 N006 10k
R11 N006 N009 10k
R12 N009 N012 10k
R13 N012 N015 10k
R14 N015 N018 10k
R15 N018 N021 10k
R16 N021 V- 10k
XX9 V+ V- A ~A inverter
XX10 V+ V- B ~B inverter
XX11 V+ V- C ~C inverter
XX12 N021 Out N022 N023 V+ V- passgate
XX13 N018 Out N019 N020 V+ V- passgate
XX14 N015 Out N016 N017 V+ V- passgate
XX15 N012 Out N013 N014 V+ V- passgate
XX16 N009 Out N010 N011 V+ V- passgate
XX17 N006 Out N007 N008 V+ V- passgate
XX18 N003 Out N004 N005 V+ V- passgate
XX19 Rin Out N001 N002 V+ V- passgate
XX20 N001 N002 A B C V- V+ 3-n-and
XX21 N004 N005 A B ~C V- V+ 3-n-and
XX22 N007 N008 A ~B C V- V+ 3-n-and
XX23 N010 N011 A ~B ~C V- V+ 3-n-and
XX24 N013 N014 ~A B C V- V+ 3-n-and
XX25 N016 N017 ~A B ~C V- V+ 3-n-and
XX26 N019 N020 ~A ~B C V- V+ 3-n-and
XX27 N022 N023 ~A ~B ~C V- V+ 3-n-and
.ends dac

.subckt inverter V+ V- A ~A
M1 ~A A V- V- NMOS l=0.6um w=1.8um
M2 ~A A V+ V+ PMOS l=0.6um w=1.8um
.ends inverter

.subckt passgate In Out ~A A V+ V-
M1 In A Out V- NMOS l=0.6um w=1.8um
M2 Out ~A In V+ PMOS l=0.6um w=1.8um
.ends passgate

.subckt 3-n-and ~Z Z A B C V- V+
M1 ~Z C N001 V- NMOS l=0.6um w=1.8um
M2 N001 B N002 V- NMOS l=0.6um w=1.8um
M3 N002 A V- V- NMOS l=0.6um w=1.8um
M4 ~Z A V+ V+ PMOS l=0.6um w=1.8um
M5 ~Z B V+ V+ PMOS l=0.6um w=1.8um
M6 ~Z C V+ V+ PMOS l=0.6um w=1.8um
M7 Z ~Z V+ V+ PMOS l=0.6um w=1.8um
M8 Z ~Z V- V- NMOS l=0.6um w=1.8um
.lib engr3426.sub
.ends 3-n-and

.subckt opamp V1 V2 V+ V- Vout Iin
XX2 V+ V- V1 Vbn Vcn Vcp Vbp V2 Vout fcdamp
XX1 V- V+ Vbn Vbp Vcp Vcn Iin bias
.ends opamp

.subckt fcdamp V+ V- V1 Vbn Vcn Vcp Vbp V2 Vout
M1 N002 Vbp V+ V+ PMOS l=1.8um w=36um
M2 N006 V1 N002 V+ PMOS l=1.8um w=36um
M3 N005 V2 N002 V+ PMOS l=1.8um w=36um
M4 Vout Vcp N004 V+ PMOS l=1.8um w=36um
M5 N004 N001 V+ V+ PMOS l=1.8um w=36um
M6 N001 Vcp N003 V+ PMOS l=1.8um w=36um
M7 N003 N001 V+ V+ PMOS l=1.8um w=36um
M8 Vout Vcn N005 V- NMOS l=1.8um w=36um
M9 N005 Vbn V- V- NMOS l=1.8um w=36um
M10 N001 Vcn N006 V- NMOS l=1.8um w=36um
M11 N006 Vbn V- V- NMOS l=1.8um w=36um
.ends fcdamp

.subckt bias V- V+ Vbn Vbp Vcp Vcn Iin
M1 V- Iin Vcp V- NMOS l=1.8um w=36um
M2 V- Iin Iin V- NMOS l=1.8um w=36um
M3 Iip Iin V- V- NMOS l=1.8um w=36um
M4 N002 Vbn V- V- NMOS l=1.8um w=36um
M5 Vbn Vbn N002 V- NMOS l=1.8um w=36um
M6 Vcn Vcn N002 V- NMOS l=1.8um w=36um
M7 Vbp Iin V- V- NMOS l=1.8um w=1.8um
M8 V+ Iip Iip V+ PMOS l=1.8um w=36um
M9 N001 Vcp Vcp V+ PMOS l=1.8um w=36um
M10 Vbn Iip V+ V+ PMOS l=1.8um w=1.8um
M11 Vcn Iip V+ V+ PMOS l=1.8um w=36um
M12 V+ Vbp N001 V+ PMOS l=1.8um w=36um
M13 N001 Vbp Vbp V+ PMOS l=1.8um w=36um
* 1/20
* 1/20
.tran 1ms
.ends bias

.subckt 2-or A B V- V+ Z
M2 N001 A V- V- NMOS l=0.6um w=1.8um
M5 N002 N001 V+ V+ PMOS l=0.6um w=3.6um
M6 N002 N001 V- V- NMOS l=0.6um w=1.8um
M1 V- B N001 V- NMOS l=0.6um w=1.8um
M3 N001 A N004 V+ PMOS l=0.6um w=1.8um
M4 V+ B N004 V+ PMOS l=0.6um w=1.8um
M7 N003 N002 V- V- NMOS l=0.6um w=18um
M8 Z N003 V- V- NMOS l=0.6um w=180um
M9 N003 N002 V+ V+ PMOS l=0.6um w=36um
M10 Z N003 V+ V+ PMOS l=0.6um w=360um
.ends 2-or

.model D D
.lib standard.dio
.model NMOS NMOS
.model PMOS PMOS
.lib standard.mos
.lib engr3426.sub
.tran 30ms
.backanno
.end